# Altium schematic sheet battery_monitor.SchDoc
size A4; SheetNumber: 2; SheetTotal: 3
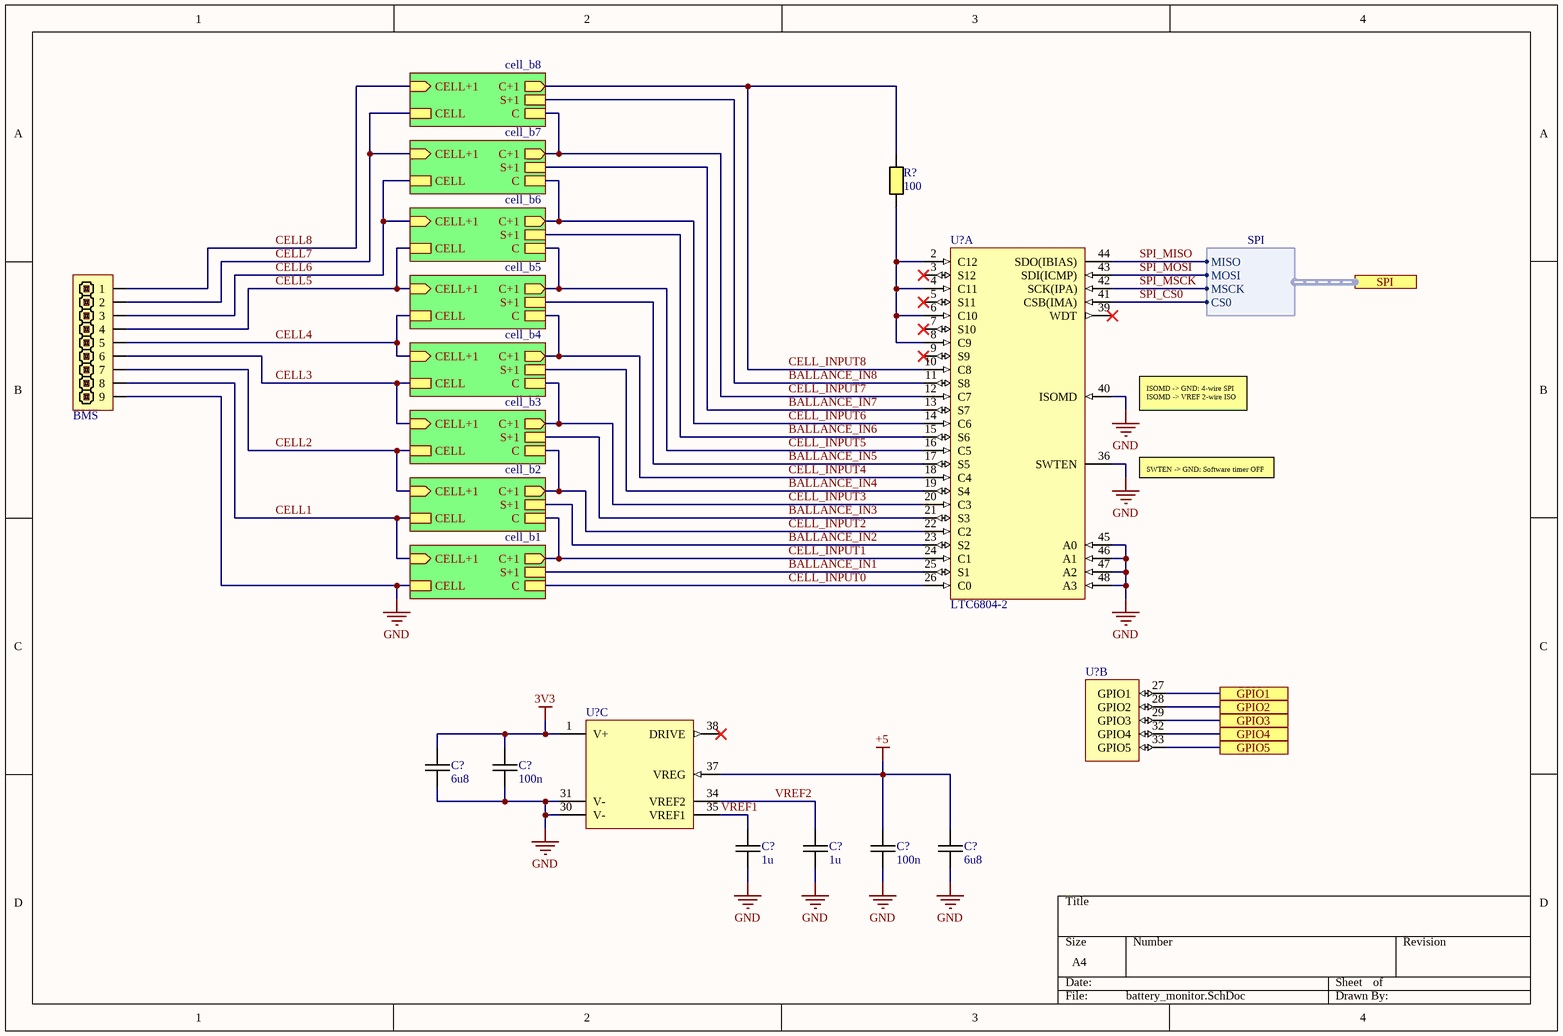
[diagram p0: battery_monitor.SchDoc]

## Parts
(Parts that share a designator on the sheet are numbered #1, #2 ... from top to bottom, then left to right.)
BMS  PIN HEADER 1x9  [XH2.54 9P]  (value not drawn)
C?#1  6u8  [CAPC0805(2012)75_N]
C?#2  100n  [CAPC0201(0603)33_N]
C?#3  1u  [CAPC0805(2012)75_N]
C?#4  1u  [CAPC0805(2012)75_N]
C?#5  100n  [CAPC0201(0603)33_N]
C?#6  6u8  [CAPC0805(2012)75_N]
R?  100  [RESC0201(0603)_N]
U?#1  LTC6804-2  [SSOP48]  (part A of 3)
U?#2  LTC6804-2  [SSOP48]  (value not drawn)  (part B of 3)
U?#3  LTC6804-2  [SSOP48]  (value not drawn)  (part C of 3)

## Sub-sheets
cell_b1 = cell_ballance.SchDoc: CELL, S+1, C, CELL+1 (in), C+1 (out)
cell_b2 = cell_ballance.SchDoc: CELL, S+1, C, CELL+1 (in), C+1 (out)
cell_b3 = cell_ballance.SchDoc: CELL, S+1, C, CELL+1 (in), C+1 (out)
cell_b4 = cell_ballance.SchDoc: CELL, S+1, C, CELL+1 (in), C+1 (out)
cell_b5 = cell_ballance.SchDoc: CELL, S+1, C, CELL+1 (in), C+1 (out)
cell_b6 = cell_ballance.SchDoc: CELL, S+1, C, CELL+1 (in), C+1 (out)
cell_b7 = cell_ballance.SchDoc: CELL, S+1, C, CELL+1 (in), C+1 (out)
cell_b8 = cell_ballance.SchDoc: CELL, S+1, C, CELL+1 (in), C+1 (out)

## Ports
GPIO1, GPIO2, GPIO3, GPIO4, GPIO5, SPI (harness SPI)

## Harnesses
SPI: MSCK, MOSI, MISO, CS0

## Nets
3V3: C?#1.1 C?#2.1 U?#3.1(V+)
+5: C?#5.1 C?#6.1 U?#3.37(VREG)
GND: BMS.9 C?#1.2 C?#2.2 C?#3.2 C?#4.2 C?#5.2 C?#6.2 U?#1.36(SWTEN) U?#1.40(ISOMD) U?#1.45(A0) U?#1.46(A1) U?#1.47(A2) U?#1.48(A3) U?#3.30(V-) U?#3.31(V-) ; sheet cell_b1/CELL
BALLANCE_IN1: U?#1.25(S1) ; sheet cell_b1/S+1
BALLANCE_IN2: U?#1.23(S2) ; sheet cell_b2/S+1
BALLANCE_IN3: U?#1.21(S3) ; sheet cell_b3/S+1
BALLANCE_IN4: U?#1.19(S4) ; sheet cell_b4/S+1
BALLANCE_IN5: U?#1.17(S5) ; sheet cell_b5/S+1
BALLANCE_IN6: U?#1.15(S6) ; sheet cell_b6/S+1
BALLANCE_IN7: U?#1.13(S7) ; sheet cell_b7/S+1
BALLANCE_IN8: U?#1.11(S8) ; sheet cell_b8/S+1
CELL1: BMS.8 ; sheet cell_b1/CELL+1, sheet cell_b2/CELL
CELL2: BMS.7 ; sheet cell_b2/CELL+1, sheet cell_b3/CELL
CELL3: BMS.6 ; sheet cell_b3/CELL+1, sheet cell_b4/CELL
CELL4: BMS.5 ; sheet cell_b4/CELL+1, sheet cell_b5/CELL
CELL5: BMS.4 ; sheet cell_b5/CELL+1, sheet cell_b6/CELL
CELL6: BMS.3 ; sheet cell_b6/CELL+1, sheet cell_b7/CELL
CELL7: BMS.2 ; sheet cell_b7/CELL+1, sheet cell_b8/CELL
CELL8: BMS.1 ; sheet cell_b8/CELL+1
CELL_INPUT0: U?#1.26(C0) ; sheet cell_b1/C
CELL_INPUT1: U?#1.24(C1) ; sheet cell_b1/C+1, sheet cell_b2/C
CELL_INPUT2: U?#1.22(C2) ; sheet cell_b2/C+1, sheet cell_b3/C
CELL_INPUT3: U?#1.20(C3) ; sheet cell_b3/C+1, sheet cell_b4/C
CELL_INPUT4: U?#1.18(C4) ; sheet cell_b4/C+1, sheet cell_b5/C
CELL_INPUT5: U?#1.16(C5) ; sheet cell_b5/C+1, sheet cell_b6/C
CELL_INPUT6: U?#1.14(C6) ; sheet cell_b6/C+1, sheet cell_b7/C
CELL_INPUT7: U?#1.12(C7) ; sheet cell_b7/C+1, sheet cell_b8/C
CELL_INPUT8: R?.2 U?#1.10(C8) ; sheet cell_b8/C+1
GPIO1: U?#2.27(GPIO1) ; port GPIO1
GPIO2: U?#2.28(GPIO2) ; port GPIO2
GPIO3: U?#2.29(GPIO3) ; port GPIO3
GPIO4: U?#2.32(GPIO4) ; port GPIO4
GPIO5: U?#2.33(GPIO5) ; port GPIO5
SPI_CS0: U?#1.41(CSB(IMA)) ; port SPI.CS0
SPI_MISO: U?#1.44(SDO(IBIAS)) ; port SPI.MISO
SPI_MOSI: U?#1.43(SDI(ICMP)) ; port SPI.MOSI
SPI_MSCK: U?#1.42(SCK(IPA)) ; port SPI.MSCK
VREF1: C?#3.1 U?#3.35(VREF1)
VREF2: C?#4.1 U?#3.34(VREF2)
NetR?_1: R?.1 U?#1.2(C12) U?#1.4(C11) U?#1.6(C10) U?#1.8(C9)

Not connected (* = marked no-connect by the designer): U?#1 3(S12)* 5(S11)* 7(S10)* 9(S9)* 39(WDT)*; U?#3 38(DRIVE)*

## Notes on the sheet
- ISOMD -> GND: 4-wire SPI
  ISOMD -> VREF 2-wire ISO
- SWTEN -> GND: Software timer OFF

## Library data of the parts
BMS = PIN HEADER 2.54 1x9
C?#1-C?#6 = Capacitor M: Ceramic capacitor Medium density
  C?#1 C?#6: Value: 6u8
  C?#2 C?#5: Value: 100n
  C?#3 C?#4: Value: 1u
R? = Resistor M: Resistor Medium Density; Value: 100
U?#1-U?#3 = LTC6804-2: The LTC®6804 is a 3rd generation multicell battery stack / monitor that measures up to 12 series connected battery / cells with a total measurement error of less than 1.2mV. The / cell measurement range of 0V to 5V makes the LTC6804 / suitable for most battery chemistries. All 12 cell voltages / can be captured in 290µs, and lower data acquisition rates / can be selected for high noise reduction.